# Altium schematic sheet auto-discharge.SchDoc
size A; SheetNumber: 5
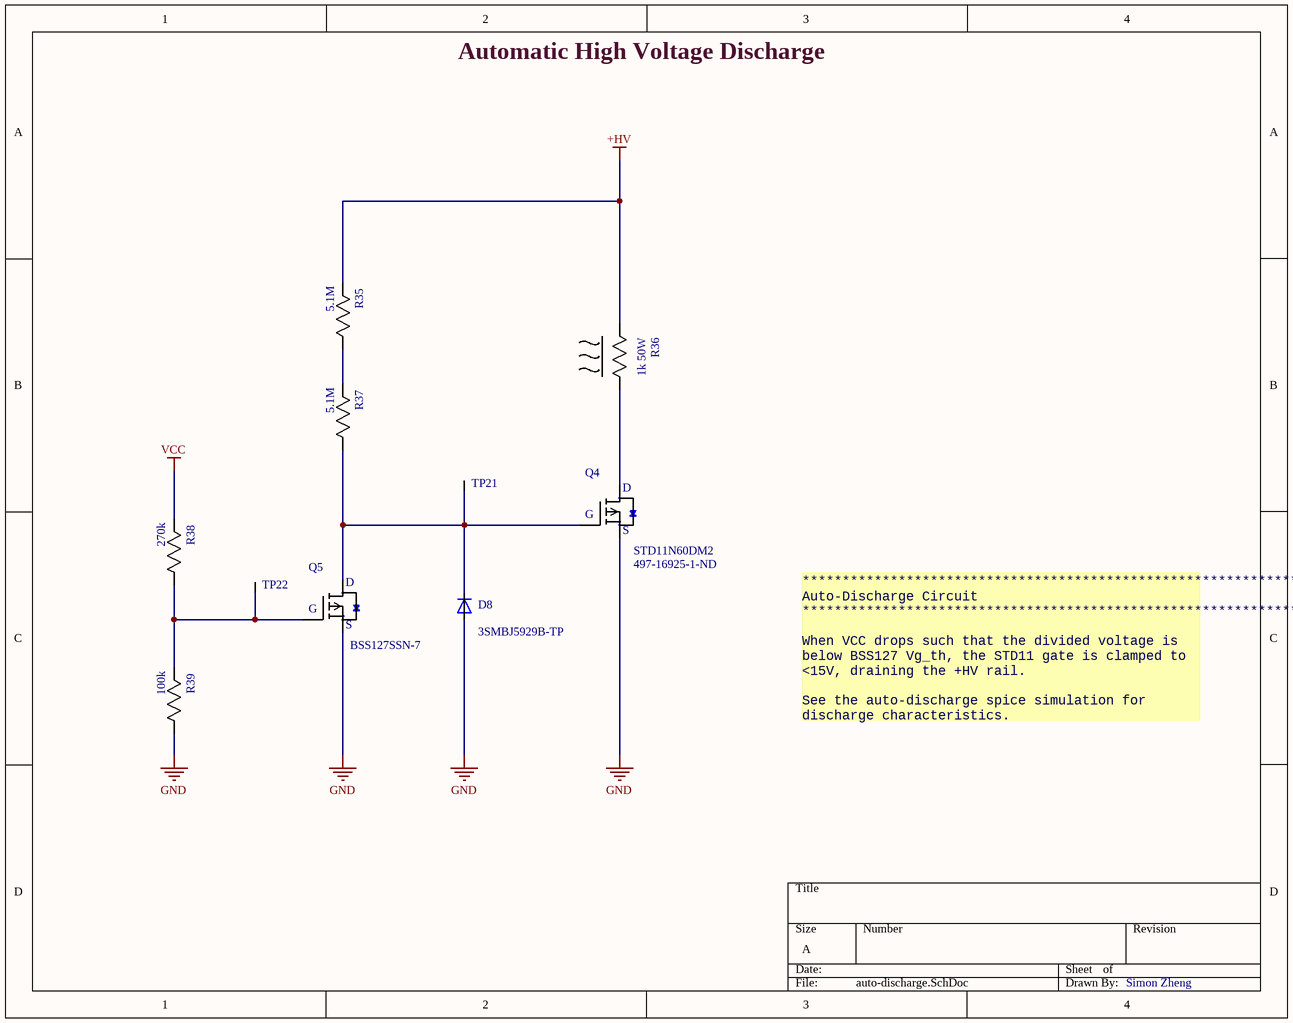
[diagram p0: auto-discharge.SchDoc]

## Parts
D8  3SMBJ5929B-TP  [DO-214AA]
Q4  STD11N60DM2  Supplier Part Number 1: 497-16925-1-ND  [DPAK (TO-252)]
Q5  BSS127SSN-7  [SOT95P245X89-3M]
R35  5.1M  [0805]
R36  1k 50W  [D2PAK (TO-263)]
R37  5.1M  [0805]
R38  270k  [0805]
R39  100k  [0805]
TP21  Test Point (Via)  [TP]  (value not drawn)
TP22  Test Point (Via)  [TP]  (value not drawn)

## Nets
+HV: R35.2(R2) R36.2(R2)
GND: D8.A Q4.S Q5.S R39.1(R1)
VCC: R38.2(R2)
NetD8_C: D8.C Q4.G Q5.D R37.1(R1) TP21.1
NetQ4_D: Q4.D R36.1(R1)
NetQ5_G: Q5.G R38.1(R1) R39.2(R2) TP22.1
NetR35_1: R35.1(R1) R37.2(R2)

Not connected (* = marked no-connect by the designer): R36 3

## Notes on the sheet
- Automatic High Voltage Discharge
- **********************************************************************
  Auto-Discharge Circuit
  **********************************************************************
  When VCC drops such that the divided voltage is below BSS127 Vg_th, the STD11 gate is clamped to <15V, draining the +HV rail.
  See the auto-discharge spice simulation for discharge characteristics.
- Simon Zheng

## Library data of the parts
D8 = DIODE ZENER 15V 3W: Supplier 1: Digi-Key; Supplier Part Number 1: 3SMBJ5929BTPMSCT-ND
Q4 = STD11N60DM2: pin to pad: D>2 G>1 S>3; MFG: STMicroelectronics; Supplier: Digikey; Supplier PN: 497-16925-1-ND; Supplier 1: Digi-Key
Q5 = BSS127SSN-7: Small Signal N-Ch, 600Vds; MFG: Diodes Incorporated; Supplier: Digikey; Supplier PN: BSS127SSN-7DICT-ND
R35 R37 = RES 5.1M 1/8W-5%: RES SMD 5.1 MOHM 5% 1/8W 0805; Power (Watts): 0.125W; Package: 0805; Value: 5.1M; Tolerance: 5%
R36 = RES 1.5k 50W: RES SMD 1.5K OHM 1% 50W D2PAK; Package: D2PAK (TO-263); Value: 1.5k; Power (Watts): 50W; Tolerance: 1%
R38 = RES 270k 1/8W: RES SMD 270K OHM 5% 1/8W 0805; Power (Watts): 0.125W; Package: 0805; Value: 270k; Tolerance: 5%
R39 = RES 100k 1/8W - 1%: RES SMD 100K OHM 1% 1/8W 0805; Power (Watts): 0.125W; Package: 0805; Value: 100k; Tolerance: 1%